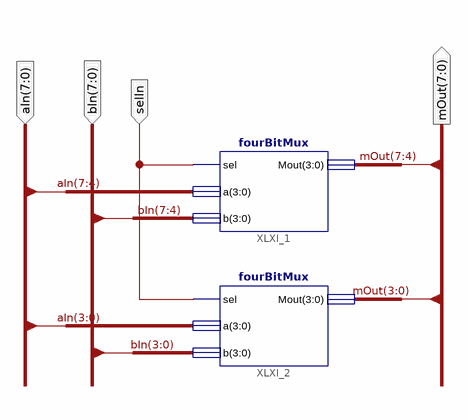
[diagram p0: schematic sheet 1]
// Xilinx ISE schematic eightBitMux.sch (spartan3e) as structural Verilog: 2 symbols, 4 ports
module eightBitMux (
  input  [7:0] aIn,
  input  [7:0] bIn,
  input  selIn,
  output [7:0] mOut
);

  fourBitMux XLXI_1 (.sel(selIn), .a(aIn[7:4]), .b(bIn[7:4]), .Mout(mOut[7:4]));
  fourBitMux XLXI_2 (.sel(selIn), .a(aIn[3:0]), .b(bIn[3:0]), .Mout(mOut[3:0]));
endmodule
